# Altium schematic sheet MCU099_05_XDS110-ET_USB_Power.SchDoc: XDS110-ET USB Power
size 431 x 279 mm; DrawnBy: Johnson He; SheetNumber: 5; SheetTotal: 6; PageSetup: Record=PageOptions|CenterHorizontal=True|CenterVertical=True|PrintScale=0.97|XCorrection=1.00|YCorrection=1.00|PrintKind=0|BorderSize=5000000|LeftOffset=0|BottomOffset=0|Orientation=2|PaperLength=1000|PaperWidth=1000|Scale=100|PaperSource=15|PrintQuality=600|MediaType=1|DitherType=10|PaperKind=Letter|PrintScaleMode=1
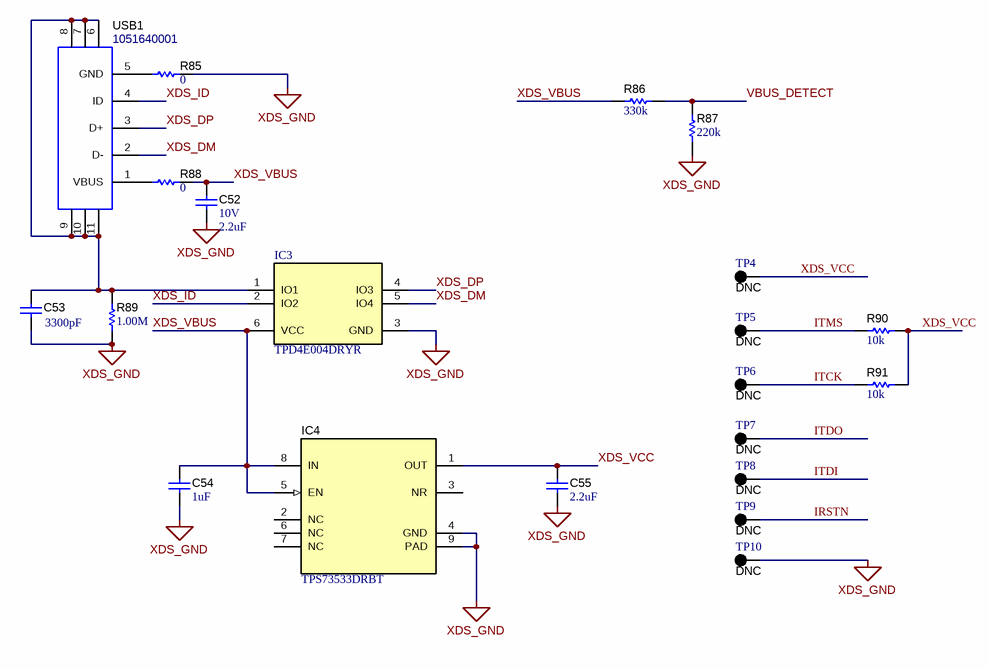
[diagram p0: MCU099_05_XDS110-ET_USB_Power.SchDoc]

## Parts
C52  VDC_V: 10V  ValueDisplayed: 2.2uF  [0603]  (hidden comment: C0603C225K8PACTU)
C53  ValueDisplayed: 3300pF  [0402]  (hidden comment: GRM155R71H332KA01D)
C54  ValueDisplayed: 1uF  [0402]  (hidden comment: C1005X5R1E105K050BC)
C55  ValueDisplayed: 2.2uF  [0402]  (hidden comment: GRM155R60J225KE95D)
IC3  TPD4E004DRYR  [DRY0006A]
IC4  TPS73533DRBT  [DRB0008A]
R85  ValueDisplayed: 0  [0603]  (hidden comment: RC0603JR-070RL)
R86  ValueDisplayed: 330k  [0402]  (hidden comment: RC0402FR-07330KL)
R87  ValueDisplayed: 220k  [0402]  (hidden comment: RC0402FR-07220KL)
R88  ValueDisplayed: 0  [0603]  (hidden comment: RC0603JR-070RL)
R89  ValueDisplayed: 1.00M  [0402]  (hidden comment: CRCW04021M00FKED)
R90  ValueDisplayed: 10k  [0402]  (hidden comment: CRCW040210K0JNED)
R91  ValueDisplayed: 10k  [0402]  (hidden comment: CRCW040210K0JNED)
TP4  DNC  [Keystone5001]  (no BOM)
TP5  DNC  [Keystone5001]  (no BOM)
TP6  DNC  [Keystone5001]  (no BOM)
TP7  DNC  [Keystone5001]  (no BOM)
TP8  DNC  [Keystone5001]  (no BOM)
TP9  DNC  [Keystone5001]  (no BOM)
TP10  DNC  [Keystone5001]  (no BOM)
USB1  1051640001  [Molex_1051640001]

## Nets
XDS_GND: C52.2 C53.2 C54.2 C55.2 IC3.3(GND) IC4.4(GND) IC4.9(PAD) R85.2 R87.1 R89.1 TP10.1
IRSTN: TP9.1
ITCK: R91.2 TP6.1
ITDI: TP8.1
ITDO: TP7.1
ITMS: R90.2 TP5.1
VBUS_DETECT: R86.2 R87.2
XDS_DM: IC3.5(IO4) USB1.2(D-)
XDS_DP: IC3.4(IO3) USB1.3(D+)
XDS_ID: IC3.2(IO2) USB1.4(ID)
XDS_VBUS: C52.1 C54.1 IC3.6(VCC) IC4.5(EN) IC4.8(IN) R86.1 R88.2
XDS_VCC: C55.1 IC4.1(OUT) R90.1 R91.1 TP4.1
NetC53_1: C53.1 IC3.1(IO1) R89.2 USB1.6 USB1.7 USB1.8 USB1.9 USB1.10 USB1.11
NetR85_1: R85.1 USB1.5(GND)
NetR88_1: R88.1 USB1.1(VBUS)

Not connected (* = marked no-connect by the designer): IC4 2(NC) 3(NR) 6(NC) 7(NC)

## Notes on the sheet
- Drawn By:
- SVN Rev:
- Number:
- TID #:
- Orderable:
- Rev:
- Sheet Title:
- File:
- Project Title:
- Designed for:
- Assembly Variant:
- Mod. Date:
- Sheet:
- Size:
- of
- B
- http://www.ti.com
- Texas Instruments and/or its licensors do not warrant the accuracy or completeness of this specification or any information contained therein. Texas Instruments and/or its licensors do not warrant that this design will meet the specifications, will be suitable for your application or fit for any particular purpose, or will operate in an implementation. Texas Instruments and/or its licensors do not warrant that the design is production worthy. You should completely validate and test your design implementation to confirm the system functionality for your application.
- Engineer:
- Contact:
- © Texas Instruments

## Library data of the parts
C52 = CMP-0006906-5: CAP, CERM, 2.2 uF, 10 V, +/- 10%, X5R, 0603; Manufacturer: Kemet; TaMin_C: -55°C; Polarized: N; SizeAreaWB_mm2: 4.68; Value1: Unknown; U/M: EA; Value: 2.2uF; TaMax_C: 85°C; SizeZ_mm: 1; SizeX_mm: 1.6; SizeY_mm: 0.8; SizeArea_mm2: 1.28; Cap_F: 2.2µF; AEC Category: Q200; Publisher: Texas Instruments; TempCo: X5R; Published: 2008-06-19; RoHS: Y; MountType: SMT; Supplier 1: Digi-Key; PackageReference: 0603; Tolerance_%: 10%; Cap_Case: 0603; Value2: 10V; CompType: Capacitor; LatestRevisionDate: 2017-03-09; PartNumber: C0603C225K8PACTU; AEC Qualified: ?; ComponentLink1Description: Datasheet link; Supplier Part Number 1: 399-4911-1-ND; Technology: Ceramic; ComponentLink1URL: http://www.kemet.com/kemet/web/homepage/kechome.nsf/vapubfiles/F3102_Y5V.pdf/$file/F3102_Y5V.pdf; Supplier 2: Mouser; Supplier 3: Farnell; Supplier Part Number 2: 80-C0603C225K8P; Supplier Part Number 3: 1108322
C53 = CMP-0006688-2: CAP, CERM, 3300 pF, 50 V, +/- 10%, X7R, 0402; Manufacturer: MuRata; TaMin_C: -55°C; Polarized: N; SizeAreaWB_mm2: 3; Value1: Unknown; U/M: EA; Value: 3300pF; TaMax_C: 125°C; SizeZ_mm: 0.6; SizeX_mm: 1; SizeY_mm: 0.5; Value2: 50V; Cap_F: 3.3nF; AEC Category: Q200; Supplier Part Number 2: 81-GRM36X332K50; Publisher: Texas Instruments; Supplier 2: Mouser; TempCo: X7R; Published: 2008-06-19; RoHS: Y; MountType: SMT; Supplier 1: Digi-Key; PackageReference: 0402; Tolerance_%: 10%; Cap_Case: 0402; SizeArea_mm2: 0.5; CompType: Capacitor; LatestRevisionDate: 2017-03-09; PartNumber: GRM155R71H332KA01D; AEC Qualified: ?; VDC_V: 50V; ComponentLink1Description: Datasheet link; Supplier Part Number 1: 490-3248-1-ND; Technology: Ceramic; ComponentLink1URL: http://search.murata.co.jp/Ceramy/PnsearchViewAction.do?HnOFG=ON&HnNFG=ON&SEL_CNT=50&sLang=en&sKey=GRM155R71H332KA01D&x=9&y=9&search=startwith
C54 = CMP-0006276-2: CAP, CERM, 1 uF, 25 V, +/- 10%, X5R, 0402; Manufacturer: TDK; TaMin_C: -55°C; Polarized: N; SizeAreaWB_mm2: 3; Value1: Unknown; U/M: EA; Value: 1uF; TaMax_C: 80°C; SizeZ_mm: 0.6; SizeX_mm: 1; SizeY_mm: 0.5; Value2: 25V; Cap_F: 1µF; AEC Category: Q200; ComponentLink1URL: https://product.tdk.com/info/en/catalog/datasheets/mlcc_commercial_general_en.pdf; Supplier Part Number 2: 07W9127; Publisher: Texas Instruments; Supplier 2: Newark; Supplier Part Number 3: 810-C1005X5R1E105K; TempCo: X5R; Supplier 3: Mouser; Published: 2008-06-19; RoHS: Y; MountType: SMT; Supplier 1: Digi-Key; PackageReference: 0402; Tolerance_%: 10%; Cap_Case: 0402; SizeArea_mm2: 0.5; CompType: Capacitor; PartNumber: C1005X5R1E105K050BC; AEC Qualified: N; VDC_V: 25V; ComponentLink1Description: Datasheet link; Supplier Part Number 1: 445-9066-1-ND; LatestRevisionDate: 2017-03-09; Technology: Ceramic; AEC Grade: N/A
C55 = CMP-0006543-2: CAP, CERM, 2.2 uF, 6.3 V, +/- 10%, X5R, 0402; Manufacturer: MuRata; TaMin_C: -55°C; Polarized: N; SizeAreaWB_mm2: 3; Value1: Unknown; U/M: EA; Value: 2.2uF; TaMax_C: 85°C; SizeZ_mm: 0.6; SizeX_mm: 1; SizeY_mm: 0.5; Value2: 6.3V; Cap_F: 2.2µF; AEC Category: Q200; Publisher: Texas Instruments; TempCo: X5R; Published: 2008-06-19; RoHS: Y; MountType: SMT; Supplier 1: Mouser; PackageReference: 0402; Tolerance_%: 10%; Cap_Case: 0402; SizeArea_mm2: 0.5; CompType: Capacitor; LatestRevisionDate: 2017-03-09; PartNumber: GRM155R60J225KE95D; AEC Qualified: N; VDC_V: 6.3V; ComponentLink1Description: Datasheet link; AEC Grade: N/A; Supplier Part Number 1: 81-GRM155R60J225KE5D; Technology: Ceramic; ComponentLink1URL: http://psearch.en.murata.com/capacitor/product/GRM155R60J225KE95%23.pdf
IC3 = CMP-0043115-1: ESD-Protection Array for High-Speed Data Interfaces, 4 Channels, -40 to +85 degC, 6-pin SON (DRY), Green (RoHS & no Sb/Br); Manufacturer: Texas Instruments; IO Leakage Current(nA): 1; USB High Speed: TRUE; IO Capacitance(Typ)(pF): 1.6; SubFamily: ESD Solution; IEC 61000-4-2 Contact(+/- kV): 8; Breakdown Voltage(Min)(V): 6; IEC 61000-4-2 Air-Gap(+/- kV): 12; PackageVersion: revF, Dec-2011; ComponentLink3URL: SamplesURL:http://www.ti.com/product/tpd4e004#samples; DatasheetVersion: SLVS729A; Eco-Plan: Green (RoHS & no Sb/Br); ComponentLink1Description: Manufacturer URL; Mounting Technology: Surface Mount; ComponentLink2URL: http://www.ti.com/general/docs/lit/getliterature.tsp?genericPartNumber=TPD4E004&fileType=pdf; ComponentLink1URL: http://www.ti.com/; PackageDescription: 6-Pin Plastic Small Outline No-Lead, 1 x 1.45 x 0.6 mm Body, 0.5 mm Pitch; 1394 / Firewire: TRUE; PackageReference: DRY0006A; ComponentLink3Description: URL Link1; ComponentLink2Description: Datasheet; Serial ATA / eSATA: TRUE; PartNumber: TPD4E004DRYR
IC4 = CMP-0036329-3: 500mA, Adjustable, Low Quiescent Current, Low-Noise, High-PSRR, Single-Output LDO Regulator, DRB0008A (VSON-8); Manufacturer: Texas Instruments; AEC Category: Q200; Vout Adj(Max)(V): 3.3; Vdo(Typ)(mV): 280; SizeY_mm: 3.0; Vin(Max)(V): 6.5; Accuracy(%): 2; Vin(Min)(V): 2.7; SizeAreaWB_mm2: 16.0; SizeZ_mm: 1.0; AEC Qualified: N; SizeArea_mm2: 9.0; Iout(Max)(A): 0.5; Rating: Catalog; Iq(Typ)(mA): 0.04; CompType: IC; MountType: SMT; PackageReference: DRB0008A; Fixed Output Options(V): 3.3; RoHS: Y; SizeX_mm: 3.0; ComponentLink2URL: http://www.ti.com/product/tps735; ComponentLink2Description: Product Folder; Operating Temperature Range: -40 to 125 C; PartNumber: TPS73533DRBT; ComponentLink3Description: Online Datasheet; ComponentLink1Description: Datasheet Link; ComponentLink1URL: http://www.ti.com/lit/ds/symlink/tps735.pdf; PackageDescription: VSON-8; Vout Adj(Min)(V): 3.3; ComponentLink3URL: http://www.ti.com/product/tps735/datasheet
R85 R88 = CMP-0025885-5: RES, 0, 5%, 0.1 W, 0603; Manufacturer: Yageo; Power_W: 100mW; TempCo: 200 ppm/C; Value_Code: 0000; Value: 0; EIA_Code: E24; SizeX_mm: 1.6; SizeZ_mm: 1; Value2: 0.1W; SizeArea_mm2: 1.28; AEC Qualified: N; VDC_V: 75V; AEC Category: Q200; SizeY_mm: 0.8; SizeAreaWB_mm2: 4.68; Supplier Part Number 2: 603-RC0603JR-070RL; Supplier 2: Mouser; Supplier Part Number 3: 9233130; Supplier 3: Farnell; RoHS: Y; Value1: 5%; MountType: SMT; Supplier 1: Digi-Key; PackageReference: 0603; Tolerance_%: 5%; Res_ohm: 0; CompType: Resistor; PartNumber: RC0603JR-070RL; ComponentLink1Description: Datasheet link; Supplier Part Number 1: 311-0.0GRCT-ND; Technology: Thick Film; ComponentLink1URL: http://www.yageo.com/pdf/Pu-RC0603_51_PbFree_L_2.pdf; AEC Grade: N/A
R86 = CMP-0026731-1: RES, 330 k, 1%, 0.0625 W, 0402; Manufacturer: Yageo America; Power_W: 62.5mW; TempCo: 100 ppm/C; U/M: EA; Value: 330k; SizeX_mm: 1; SizeY_mm: 0.5; SizeZ_mm: 0.6; AEC Qualified: N; VDC_V: 50V; AEC Category: Q200; ComponentLink1URL: http://www.yageo.com/documents/recent/PYu-RC0402_51_RoHS_L_6_r.pdf; Supplier Part Number 2: 98K7541; Publisher: Texas Instruments; Supplier 2: Newark; Supplier Part Number 3: 603-RC0402FR-07330KL; Supplier 3: Mouser; Published: 2008-06-26; Value_Code: 330k; RoHS: Y; Value1: 1%; MountType: SMT; Supplier 1: Digi-Key; PackageReference: 0402; Tolerance_%: 1%; Res_ohm: 330k; Value2: 0.0625W; SizeArea_mm2: 0.5; CompType: Resistor; LatestRevisionDate: 2017-03-09; PartNumber: RC0402FR-07330KL; ComponentLink1Description: Datasheet link; AEC Grade: N/A; Supplier Part Number 1: 311-330KLRCT-ND; Technology: Thick Film
R87 = CMP-0026728-1: RES, 220 k, 1%, 0.0625 W, 0402; Manufacturer: Yageo America; Power_W: 62.5mW; TempCo: 100 ppm/C; U/M: EA; Value: 220k; SizeX_mm: 1; SizeY_mm: 0.5; SizeZ_mm: 0.6; AEC Qualified: N; VDC_V: 50V; AEC Category: Q200; ComponentLink1URL: http://www.yageo.com/documents/recent/PYu-RC0402_51_RoHS_L_6_r.pdf; Supplier Part Number 2: 98K7527; Publisher: Texas Instruments; Supplier 2: Newark; Supplier Part Number 3: 603-RC0402FR-07220KL; Supplier 3: Mouser; Published: 2008-06-26; Value_Code: 220k; RoHS: Y; Value1: 1%; MountType: SMT; Supplier 1: Digi-Key; PackageReference: 0402; Tolerance_%: 1%; Res_ohm: 220k; Value2: 0.0625W; SizeArea_mm2: 0.5; CompType: Resistor; LatestRevisionDate: 2017-03-09; PartNumber: RC0402FR-07220KL; ComponentLink1Description: Datasheet link; AEC Grade: N/A; Supplier Part Number 1: 311-220KLRCT-ND; Technology: Thick Film
R89 = CMP-0026100-1: RES, 1.00 M, 1%, 0.063 W, 0402; Manufacturer: Vishay-Dale; Power_W: 63mW; TempCo: 100 ppm/C; Value_Code: 1M00; U/M: EA; Value: 1.00Meg; EIA_Code: E96; Res_ohm: 1M; SizeX_mm: 1; SizeY_mm: 0.5; SizeZ_mm: 0.6; Value2: 0.063W; VDC_V: 50V; AEC Category: Q200; ComponentLink1URL: http://www.vishay.com/docs/20035/dcrcwe3.pdf; Supplier Part Number 2: 52K6593; Publisher: Texas Instruments; Supplier 2: Newark; Supplier Part Number 3: 71-CRCW0402-1.0M-E3; Supplier 3: Mouser; Published: 2008-06-26; RoHS: Y; Value1: 1%; MountType: SMT; Supplier 1: Digi-Key; PackageReference: 0402; Tolerance_%: 1%; SizeArea_mm2: 0.5; CompType: Resistor; LatestRevisionDate: 2017-03-09; PartNumber: CRCW04021M00FKED; AEC Qualified: ?; ComponentLink1Description: Datasheet link; Supplier Part Number 1: 541-1.00MLCT-ND; Technology: Thick Film
R90 R91 = CMP-0026825-4: RES, 10 k, 5%, 0.063 W, 0402; Manufacturer: Vishay-Dale; Power_W: 63mW; TempCo: 200 ppm/C; Value_Code: 10k0; U/M: EA; Value: 10k; EIA_Code: E24; SizeX_mm: 1; SizeY_mm: 0.5; SizeZ_mm: 0.6; Value2: 0.063W; VDC_V: 50V; AEC Category: Q200; Supplier Part Number 2: 59M6696; Publisher: Texas Instruments; Supplier 2: Newark; Supplier Part Number 3: 71-CRCW0402J-10K-E3; Supplier 3: Mouser; Published: 2008-06-26; RoHS: Y; Value1: 5%; MountType: SMT; Supplier 1: Digi-Key; PackageReference: 0402; Tolerance_%: 5%; Res_ohm: 10k; SizeArea_mm2: 0.5; CompType: Resistor; LatestRevisionDate: 2017-03-09; PartNumber: CRCW040210K0JNED; AEC Qualified: ?; ComponentLink1Description: Datasheet link; Supplier Part Number 1: 541-10KJCT-ND; Technology: Thick Film; ComponentLink1URL: http://www.vishay.com/docs/20035/dcrcwe3.pdf
TP4-TP10 = CMP-0055138-1: Test Point, Miniature, Black, TH; Manufacturer: Keystone; CNHeader: FALSE; Green_Lifecycle: Active; Green_REACh: Passed; ContactFinish: Silver; CT: TRUE; ComponentLink1URL: http://www.keyelco.com/userAssets/file/M60-2p60.pdf; Supplier Part Number 2: 534-5001; Publisher: Texas Instruments; Supplier 2: Mouser; Color: Black; RoHS: Y; MountType: TH; Green_EU RoHS-2: Incomplete; Supplier 1: Digi-Key; Green_EU RoHS: Passed; PackageReference: Black Miniature Testpoint; CompType: Test Point; LatestRevisionDate: 26/05/2017; PartNumber: 5001; ComponentLink1Description: Datasheet URL; Supplier Part Number 1: 36-5001-ND
USB1 = CMP-0055311-1: Receptacle, USB 2.0, Micro B, 5 Position, R/A, SMT; Manufacturer: Molex; CNHeader: FALSE; Current_A: 1.8A; Gender: Female; Voltage_V: 30V; Pitch_mm: 0.65; ContactFinish: Gold; CT: TRUE; Cert_UL: Y; ComponentLink1URL: http://www.molex.com/pdm_docs/sd/1051640001_sd.pdf; Supplier Part Number 2: 99Y3224; Publisher: Texas Instruments; Supplier 2: Newark; Supplier Part Number 3: 538-105164-0001; Color: Black; Supplier 3: Mouser; RoHS: Y; MountType: SMT; Supplier 1: Digi-Key; PackageReference: Receptacle, USB 2.0, Micro B, 5 Pos, 0.65mm Pitch, R/A, SMT; PinCount: 5; CompType: USB; LatestRevisionDate: 26/05/2017; PartNumber: 1051640001; Orientation: R/A; ComponentLink1Description: Datasheet URL; Supplier Part Number 1: WM11263CT-ND